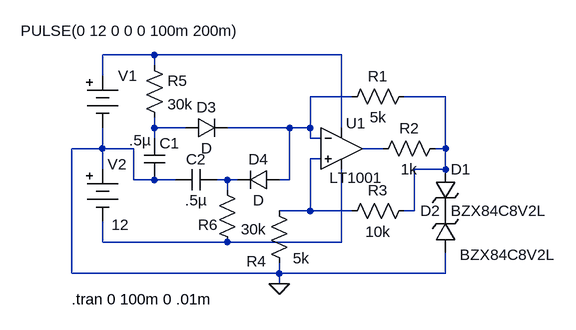
[diagram p0: schematic cuadrada_con_zona_muerta.asc]
cuadrada_con_zona_muerta.asc, the LTspice schematic file:
Version 4
SHEET 1 880 680
WIRE 32 0 -48 0
WIRE 320 0 32 0
WIRE 32 16 32 0
WIRE -48 32 -48 0
WIRE 336 64 272 64
WIRE 480 64 416 64
WIRE 32 112 32 96
WIRE 80 112 32 112
WIRE 240 112 144 112
WIRE 272 112 272 64
WIRE 272 112 240 112
WIRE 320 112 320 0
WIRE 32 128 32 112
WIRE 272 128 272 112
WIRE 288 128 272 128
WIRE -48 144 -48 112
WIRE -48 144 -96 144
WIRE 0 144 -48 144
WIRE 384 144 352 144
WIRE 480 144 480 64
WIRE 480 144 464 144
WIRE 288 160 272 160
WIRE -48 176 -48 144
WIRE 480 176 480 144
WIRE 480 176 432 176
WIRE 0 192 0 144
WIRE 32 192 0 192
WIRE 64 192 32 192
WIRE 144 192 128 192
WIRE 160 192 144 192
WIRE 240 192 240 112
WIRE 240 192 224 192
WIRE 144 208 144 192
WIRE 272 240 272 160
WIRE 272 240 224 240
WIRE 336 240 272 240
WIRE 432 240 432 176
WIRE 432 240 416 240
WIRE -48 288 -48 256
WIRE 144 288 -48 288
WIRE 320 288 320 176
WIRE 320 288 144 288
WIRE -96 336 -96 144
WIRE 224 336 224 320
WIRE 224 336 -96 336
WIRE 480 336 480 304
WIRE 480 336 224 336
WIRE 224 352 224 336
FLAG 224 352 0
SYMBOL Opamps\\LT1001 320 80 R0
WINDOW 0 7 25 Left 2
WINDOW 3 -19 109 Left 2
SYMATTR InstName U1
SYMBOL Misc\\battery -48 16 R0
WINDOW 123 0 0 Left 2
WINDOW 39 0 0 Left 2
WINDOW 3 -126 -53 Left 2
SYMATTR Value PULSE(0 12 0 0 0 100m 200m)
SYMATTR InstName V1
SYMBOL Misc\\battery -48 160 R0
WINDOW 3 14 101 Left 2
WINDOW 123 0 0 Left 2
WINDOW 39 0 0 Left 2
WINDOW 0 8 8 Left 2
SYMATTR Value 12
SYMATTR InstName V2
SYMBOL res 432 48 R90
WINDOW 0 0 56 VBottom 2
WINDOW 3 32 56 VTop 2
SYMATTR InstName R1
SYMATTR Value 5k
SYMBOL res 480 128 R90
WINDOW 0 0 56 VBottom 2
WINDOW 3 32 56 VTop 2
SYMATTR InstName R2
SYMATTR Value 1k
SYMBOL zener 464 176 R0
SYMATTR InstName D1
SYMATTR Value BZX84C8V2L
SYMBOL zener 496 304 R180
WINDOW 0 24 64 Left 2
WINDOW 3 -153 -3 Left 2
SYMATTR InstName D2
SYMATTR Value BZX84C8V2L
SYMBOL res 432 224 R90
WINDOW 0 0 56 VBottom 2
WINDOW 3 32 56 VTop 2
SYMATTR InstName R3
SYMATTR Value 10k
SYMBOL res 240 336 R180
WINDOW 0 36 19 Left 2
WINDOW 3 -31 23 Left 2
SYMATTR InstName R4
SYMATTR Value 5k
SYMBOL res 16 0 R0
SYMATTR InstName R5
SYMATTR Value 30k
SYMBOL cap 16 128 R0
WINDOW 3 -23 3 Left 2
SYMATTR Value .5µ
SYMATTR InstName C1
SYMBOL diode 80 128 R270
WINDOW 0 32 32 VTop 2
WINDOW 3 0 32 VBottom 2
SYMATTR InstName D3
SYMBOL res 128 192 R0
WINDOW 0 -29 69 Left 2
WINDOW 3 37 76 Left 2
SYMATTR InstName R6
SYMATTR Value 30k
SYMBOL cap 128 176 R90
WINDOW 0 0 32 VBottom 2
WINDOW 3 32 32 VTop 2
SYMATTR InstName C2
SYMATTR Value .5µ
SYMBOL diode 224 176 R90
WINDOW 0 0 32 VBottom 2
WINDOW 3 32 32 VTop 2
SYMATTR InstName D4
TEXT -96 376 Left 2 !.tran 0 100m 0 .01m

The netlist it stands for:
* cuadrada_con_zona_muerta.asc
XU1 N006 N002 N001 N008 N005 LT1001  ; pins In+ In- V+ V- OUT
V1 N001 0 PULSE(0 12 0 0 0 100m 200m)
V2 0 N008 12
R1 N003 N002 5k
R2 N003 N005 1k
D1 N003 P001 BZX84C8V2L
D2 0 P001 BZX84C8V2L
R3 N003 N006 10k
R4 0 N006 5k
R5 N001 N004 30k
C1 N004 0 .5µ
D3 N004 N002 D
R6 N007 N008 30k
C2 N007 0 .5µ
D4 N002 N007 D
.model D D
.lib standard.dio
.tran 0 100m 0 .01m
.lib LTC.lib
.backanno
.end